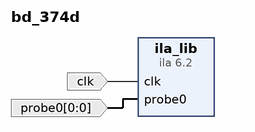
[diagram p0: block diagram of the top level]
# Vivado block design bd_374d, xc7z020clg484-1, Vivado 2020.1
create_bd_design bd_374d

create_bd_port -dir I -type clk clk
create_bd_port -dir I -from 0 -to 0 probe0

create_bd_cell -type ip -vlnv xilinx.com:ip:ila:6.2 ila_lib
set_property -dict [list \
  CONFIG.ALL_PROBE_SAME_MU TRUE \
  CONFIG.ALL_PROBE_SAME_MU_CNT 1 \
  CONFIG.C_ADV_TRIGGER FALSE \
  CONFIG.C_DATA_DEPTH 1024 \
  CONFIG.C_EN_STRG_QUAL 0 \
  CONFIG.C_EN_TIME_TAG 0 \
  CONFIG.C_ILA_CLK_FREQ 25000000 \
  CONFIG.C_INPUT_PIPE_STAGES 0 \
  CONFIG.C_MONITOR_TYPE Native \
  CONFIG.C_NUM_OF_PROBES 1 \
  CONFIG.C_PROBE0_MU_CNT 1 \
  CONFIG.C_PROBE0_TYPE 0 \
  CONFIG.C_PROBE0_WIDTH 1 \
  CONFIG.C_TIME_TAG_WIDTH 32 \
  CONFIG.C_TRIGIN_EN false \
  CONFIG.C_TRIGOUT_EN false \
  CONFIG.C_XLNX_HW_PROBE_INFO DEFAULT \
] [get_bd_cells ila_lib]

# ---- connections ----

connect_bd_net [get_bd_ports clk] [get_bd_pins ila_lib/clk]
connect_bd_net -net probe0_1 [get_bd_ports probe0] [get_bd_pins ila_lib/probe0]

validate_bd_design
save_bd_design
